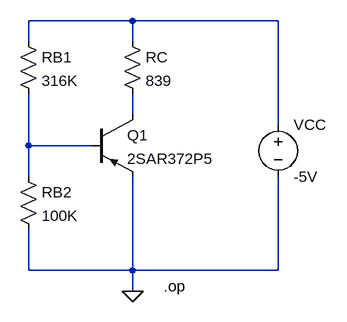
[diagram p0: schematic Fig3.asc]
Fig3.asc, the LTspice schematic file:
Version 4
SHEET 1 880 680
WIRE 464 96 304 96
WIRE 688 96 464 96
WIRE 304 128 304 96
WIRE 464 128 464 96
WIRE 464 240 464 208
WIRE 688 256 688 96
WIRE 304 288 304 208
WIRE 400 288 304 288
WIRE 304 336 304 288
WIRE 304 480 304 416
WIRE 464 480 464 336
WIRE 464 480 304 480
WIRE 688 480 688 336
WIRE 688 480 464 480
WIRE 464 512 464 480
FLAG 464 512 0
SYMBOL pnp 400 240 R0
SYMATTR InstName Q1
SYMATTR Value 2SAR372P5
SYMBOL Voltage 688 240 R0
SYMATTR InstName VCC
SYMATTR Value -5V
SYMBOL Res 288 320 R0
SYMATTR InstName RB2
SYMATTR Value 100K
SYMBOL Res 448 112 R0
SYMATTR InstName RC
SYMATTR Value 839
SYMBOL Res 288 112 R0
SYMATTR InstName RB1
SYMATTR Value 316K
TEXT 512 504 Left 2 !.op

The netlist it stands for:
* Fig3.asc
Q1 N002 N003 0 0 2SAR372P5
VCC N001 0 -5V
RB2 N003 0 100K
RC N001 N002 839
RB1 N001 N003 316K
.model NPN NPN
.model PNP PNP
.lib standard.bjt
.op
.backanno
.end